# Altium schematic sheet solarTrackSheet.SchDoc
size A4; SheetNumber: 1; SheetTotal: 1
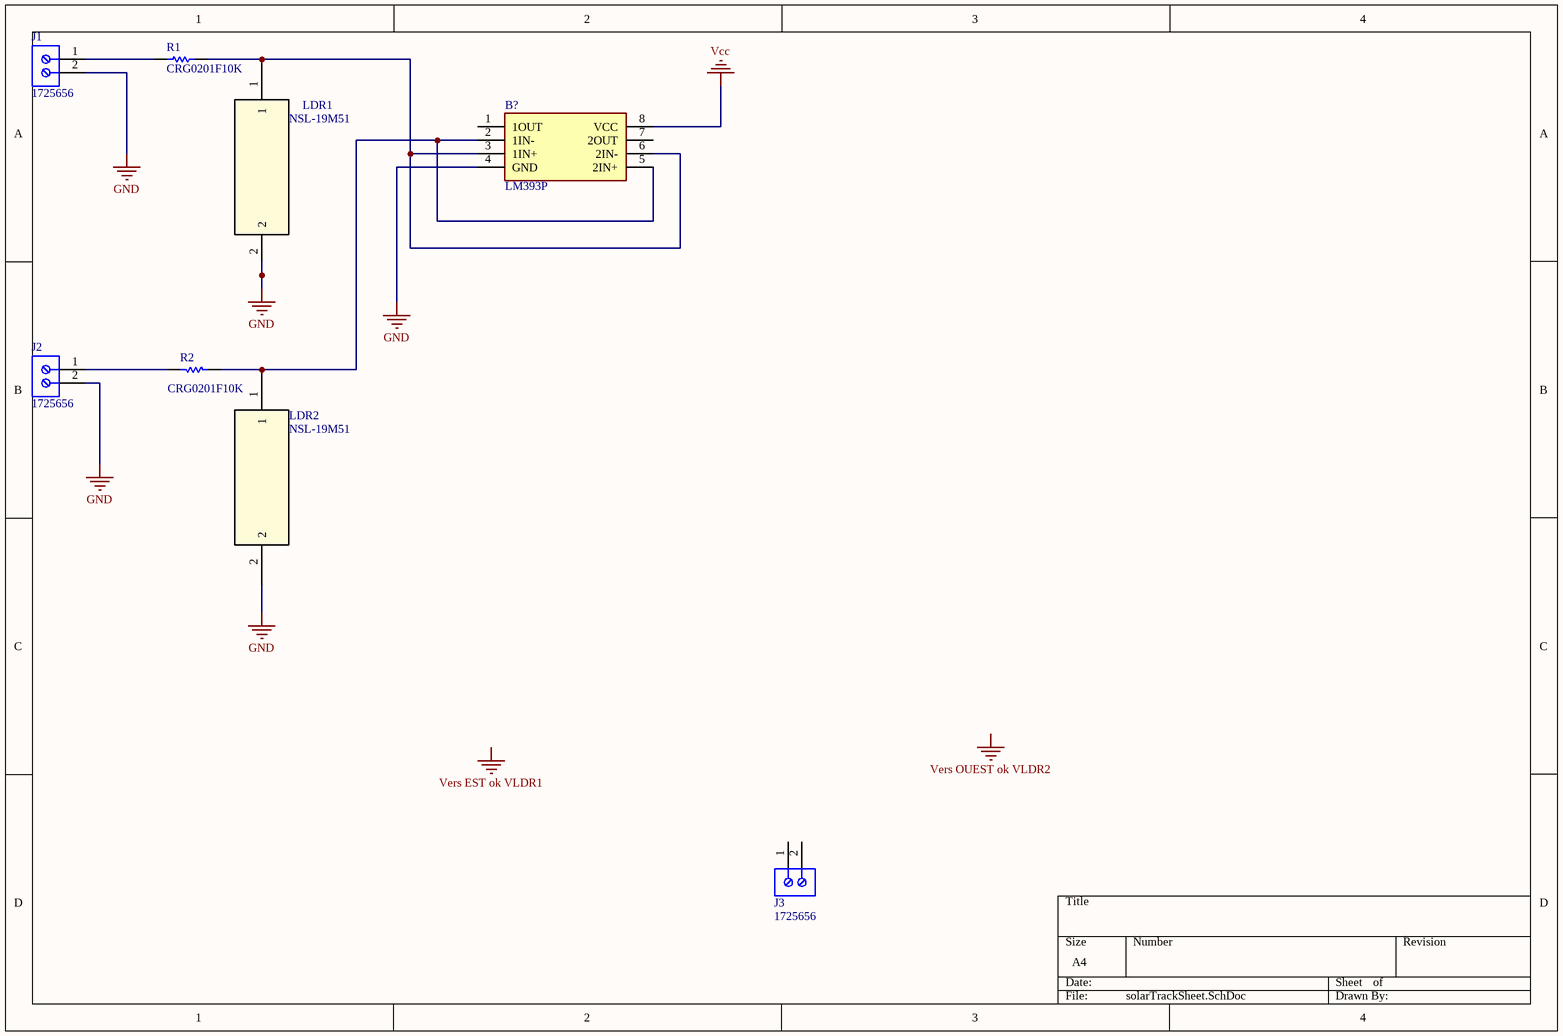
[diagram p0: solarTrackSheet.SchDoc]

## Parts
B?  LM393P  [DIP794W53P254L959H508Q8N]
J1  1725656  [PHOE-1725656-2]
J2  1725656  [PHOE-1725656-2]
J3  1725656  [PHOE-1725656-2]
LDR1  NSL-19M51  [TO_NSL_19M_ADP]
LDR2  NSL-19M51  [TO_NSL_19M_ADP]
R1  CRG0201F10K  [RESC0603X26X15NL03T05]
R2  CRG0201F10K  [RESC0603X26X15NL03T05]

## Nets
GND: B?.4(GND) J1.2 J2.2 LDR1.2 LDR2.2
Vcc: B?.8(VCC)
NetB?_2: B?.2(1IN-) B?.5(2IN+) LDR2.1 R2.1
NetB?_3: B?.3(1IN+) B?.6(2IN-) LDR1.1 R1.2
NetJ1_1: J1.1 R1.1
NetJ2_1: J2.1 R2.2

Not connected (* = marked no-connect by the designer): B? 1(1OUT) 7(2OUT); J3 1 2

## Notes on the sheet
- Labels drawn without touching a wire or pin: Vers OUEST ok VLDR2

## Library data of the parts
B? = LM393P: LM393P, Dual Comparator Open Collector 1.3us 12 V, 15 V, 18 V, 24 V, 28 V, 3 V, 5 V, 9 V 8-Pin PDIP; Manufacturer_Name: Texas Instruments; Geometry.Height: 5.08mm; Manufacturer_Part_Number: LM393P; Mouser Part Number: 595-LM393P; Mouser Price/Stock: https://www.mouser.co.uk/ProductDetail/Texas-Instruments/LM393P?qs=1K8%2FAQHn5WT5g4otW1rg%2Fg%3D%3D; Arrow Part Number: LM393P; Arrow Price/Stock: https://www.arrow.com/en/products/lm393p/texas-instruments?utm_currency=USD&region=nac; Datasheet Link: http://www.ti.com/lit/ds/symlink/lm393.pdf
J1-J3 = CMP-2000-05299-1: Male Header, Pitch 2.54 mm, 1 x 2 Position, Height 9 mm, Tail Length 3.5 mm; Manufacturer: Phoenix Contact; Number of contacts: 2; Content: 250pc(s); Pitch: 2.54mm; Industrial packaging: Yes; Colour: Green; Manufacturer part No.: 1725656; Type: MPT0,5/2-2,54; Datasheet URL: http://datasheet.octopart.com/1725656-Phoenix-Contact-datasheet-5302866.pdf; Manufacturer URL: http://www.phoenixcontact.com/; Datasheet Version: Apr-08
LDR1 LDR2 = NSL-19M51: Description; Manufacturer_Name: Advanced Photonix; Copyright: Copyright (C) 2026 Ultra Librarian. All rights reserved.; Manufacturer_Part_Number: NSL-19M51; RefDes: RefDes; Type: Type
R1 R2 = CMP-2004-03568-1: Manufacturer: TE Connectivity / AMP; Part Number: CRG0201F10K